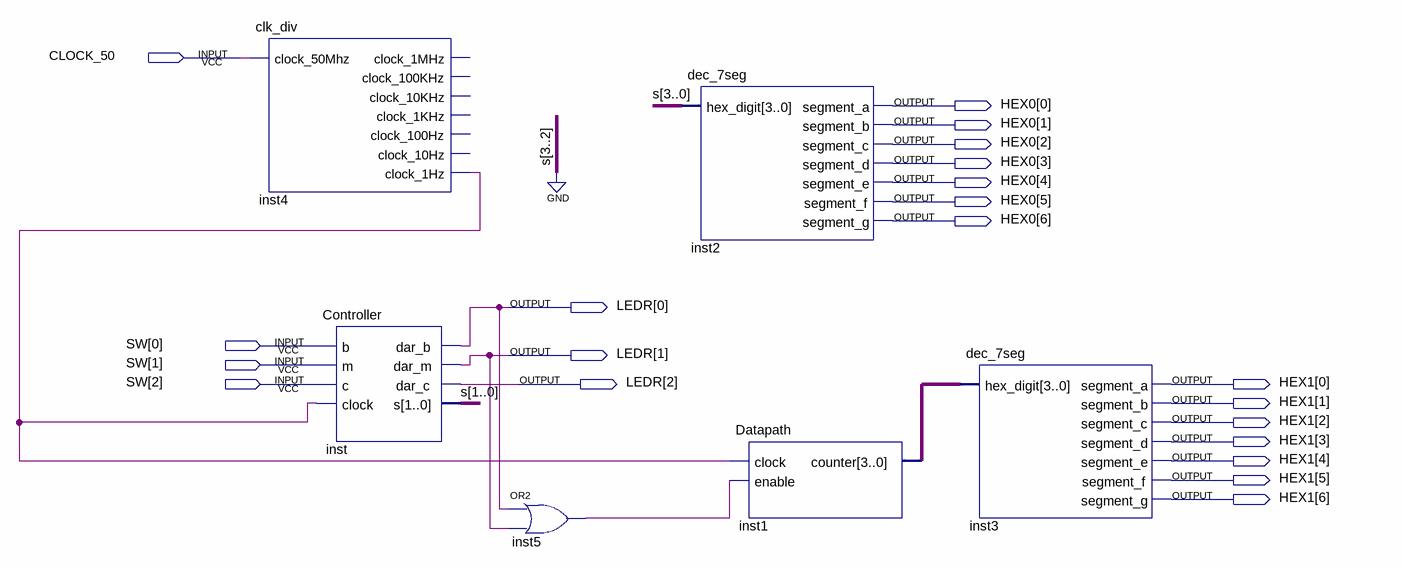
[diagram p0: schematic sheet]
// Quartus schematic Processor.bdf as structural Verilog: 6 symbols, 21 pins
module Processor (
  input  CLOCK_50,
  input  [2:0] SW,
  output [6:0] HEX0,
  output [2:0] LEDR,
  output [6:0] HEX1
);

  wire inst4_clock_1hz, inst5_out;
  wire [1:0] s;
  wire [3:0] inst1_counter;

  clk_div inst4 (
    .clock_50Mhz(CLOCK_50), .clock_1Hz(inst4_clock_1hz));  // open: clock_1MHz, clock_100KHz, clock_10KHz, clock_1KHz, clock_100Hz, clock_10Hz
  Controller inst (
    .b(SW[0]), .m(SW[1]), .c(SW[2]), .clock(inst4_clock_1hz), .dar_b(LEDR[0]), .dar_m(LEDR[1]),
    .dar_c(LEDR[2]), .s(s));
  or inst5 (inst5_out, LEDR[0], LEDR[1]);
  dec_7seg inst2 (
    .hex_digit({2'b00, s}), .segment_a(HEX0[0]), .segment_b(HEX0[1]), .segment_c(HEX0[2]),
    .segment_d(HEX0[3]), .segment_e(HEX0[4]), .segment_f(HEX0[5]), .segment_g(HEX0[6]));
  Datapath inst1 (.clock(inst4_clock_1hz), .enable(inst5_out), .counter(inst1_counter));
  dec_7seg inst3 (
    .hex_digit(inst1_counter), .segment_a(HEX1[0]), .segment_b(HEX1[1]), .segment_c(HEX1[2]),
    .segment_d(HEX1[3]), .segment_e(HEX1[4]), .segment_f(HEX1[5]), .segment_g(HEX1[6]));
endmodule
